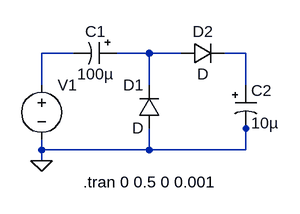
[diagram p0: schematic voltage_doubler_asymetrical.asc]
voltage_doubler_asymetrical.asc, the LTspice schematic file:
Version 4
SHEET 1 880 680
WIRE 160 96 112 96
WIRE 272 96 224 96
WIRE 320 96 272 96
WIRE 416 96 384 96
WIRE 112 144 112 96
WIRE 272 144 272 96
WIRE 416 144 416 96
WIRE 416 208 416 192
WIRE 112 240 112 224
WIRE 272 240 272 208
WIRE 272 240 112 240
WIRE 416 240 416 208
WIRE 416 240 272 240
WIRE 112 256 112 240
FLAG 112 256 0
SYMBOL voltage 112 128 R0
WINDOW 3 24 96 Invisible 2
WINDOW 123 0 0 Left 0
WINDOW 39 0 0 Left 0
SYMATTR InstName V1
SYMATTR Value SINE(0 155.56 60)
SYMBOL polcap 224 80 R90
WINDOW 0 0 32 VBottom 2
WINDOW 3 32 32 VTop 2
SYMATTR InstName C1
SYMATTR Value 100µ
SYMBOL diode 288 208 R180
WINDOW 0 24 64 Left 2
WINDOW 3 24 0 Left 2
SYMATTR InstName D1
SYMBOL diode 320 112 R270
WINDOW 0 32 32 VTop 2
WINDOW 3 0 32 VBottom 2
SYMATTR InstName D2
SYMBOL polcap 400 144 R0
SYMATTR InstName C2
SYMATTR Value 10µ
TEXT 174 288 Left 2 !.tran 0 0.5 0 0.001

The netlist it stands for:
* voltage_doubler_asymetrical.asc
V1 N001 0 SINE(0 155.56 60)
C1 N002 N001 100µ
D1 0 N002 D
D2 N002 N003 D
C2 N003 0 10µ
.model D D
.lib standard.dio
.tran 0 0.5 0 0.001
.backanno
.end